# EAGLE design xbee_remote (EAGLE 6.1)
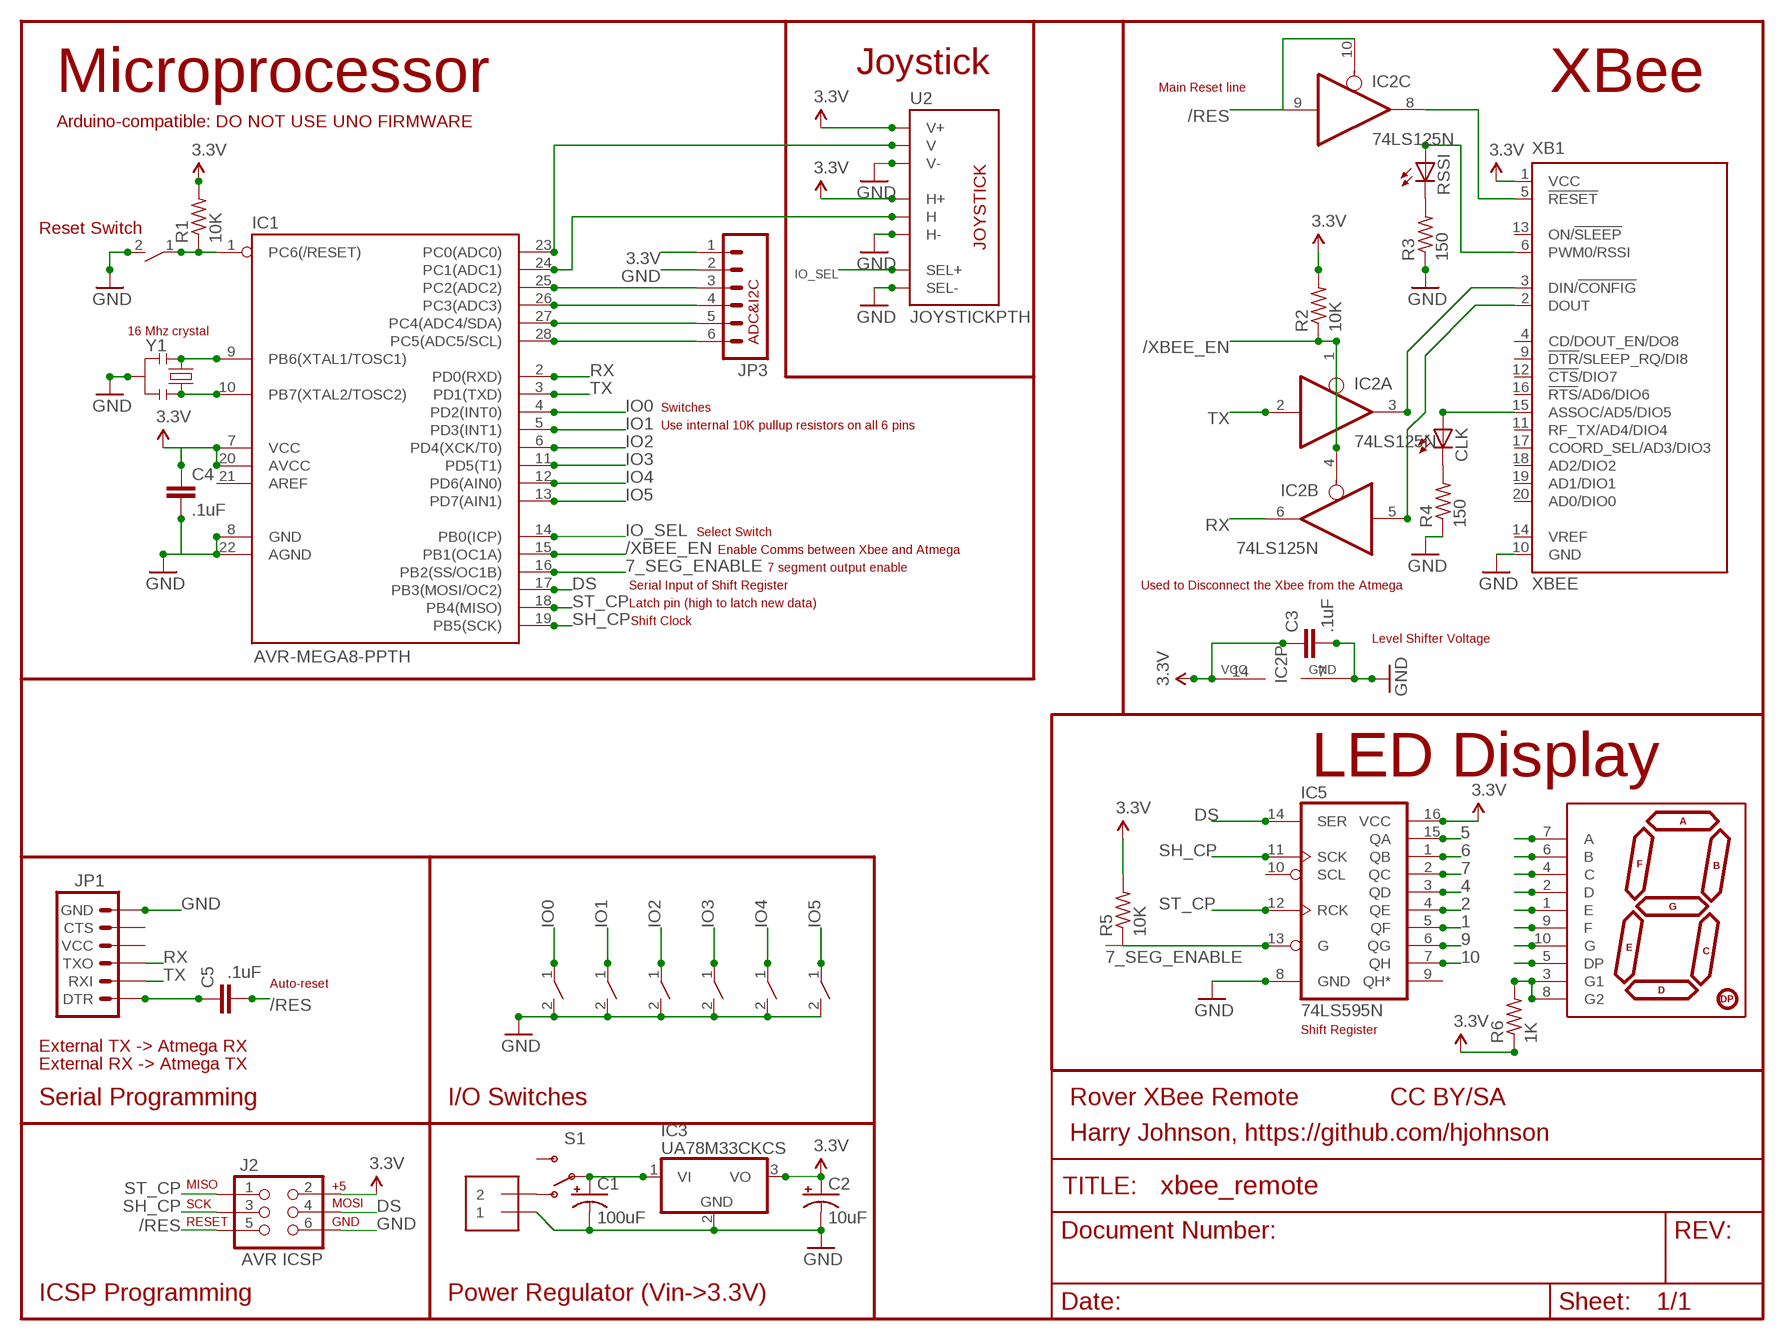
[diagram p0: schematic, sheet 1]

## Parts
C1  100uF  CAP_POLPTH1  [CPOL-RADIAL-100UF-25V]
C2  10uF  CAP_POLPTH2  [CPOL-RADIAL-10UF-25V]
C3  .1uF  CAPPTH2  [CAP-PTH-SMALL2]
C4  .1uF  CAPPTH2  [CAP-PTH-SMALL2]
C5  .1uF  CAPPTH2  [CAP-PTH-SMALL2]
CLK  LED3MM  [LED3MM]
IC1  AVR-MEGA8-PPTH  [DIL28-3]
IC2  74LS125N  [DIL14]
IC3  UA78M33CKCS  786TV  [TO220V]
IC5  74LS595N  [DIL16]
J1  1X2-3.5MM  [3.5MMTERM]
J2  AVR ICSP  AVR_SPI_PRG_6PTH  [2X3]
JP1  ARDUINO_SERIAL_PROGRAMPTH  [1X06]
JP3  M06SIP  [1X06]
R1  10K  R-US_0207/10  [0207/10]
R2  10K  R-US_0207/10  [0207/10]
R3  150  R-US_0207/10  [0207/10]
R4  150  R-US_0207/10  [0207/10]
R5  10K  R-US_0207/10  [0207/10]
R6  1K  R-US_0207/10  [0207/10]
RSSI  LED3MM  [LED3MM]
S1  SWITCH-SPSTPTH  [SWITCH-SPDT]
U2  JOYSTICKPTH  [JOYSTICK]
U$4  7-SEGMENT-DISPLAY-1"-RED  [7-SEGMENT-1"PTH]
U$8  TACT_TL1107  [TACT_TL1107]
U$9  TACT_TL1107  [TACT_TL1107]
U$10  TACT_TL1107  [TACT_TL1107]
U$11  TACT_TL1107  [TACT_TL1107]
U$12  TACT_TL1107  [TACT_TL1107]
U$13  TACT_TL1107  [TACT_TL1107]
U$14  TACT_TL1107  [TACT_TL1107]
XB1  XBEE  [XBEE]
Y1  RESONATORPTH  [RESONATOR-PTH]

## Nets
1: IC5.5(QF) U$4.1(E)
2: IC5.4(QE) U$4.2(D)
3.3V: C2.1(+) C3.1 C4.1 IC1.7(VCC) IC1.20(AVCC) IC2.14(P:VCC) IC3.3(VO) IC5.16(VCC) J2.2 JP3.1 R1.2 R2.2 R5.2 R6.1 U2.H1(H+) U2.V1(V+) XB1.1(VCC)
3V3_/RST: IC2.8(C:O) XB1.5(!RESET)
3V3_RX: IC2.5(B:I) XB1.2(DOUT)
3V3_TX: IC2.3(A:O) XB1.3(DIN/!CONFIG)
4: IC5.3(QD) U$4.4(C)
5: IC5.15(QA) U$4.5(DP)
6: IC5.1(QB) U$4.6(B)
7: IC5.2(QC) U$4.7(A)
7_SEG_ENABLE: IC1.16(PB2(SS/OC1B)) IC5.13(G) R5.1
9: IC5.6(QG) U$4.9(F)
10: IC5.7(QH) U$4.10(G)
/RES: C5.2 IC1.1(PC6(/RESET)) IC2.9(C:I) IC2.10(C:OE) J2.5 R1.1 U$8.1
/XBEE_EN: IC1.15(PB1(OC1A)) IC2.1(A:OE) IC2.4(B:OE) R2.1
A2: IC1.25(PC2(ADC2)) JP3.3
A3: IC1.26(PC3(ADC3)) JP3.4
DS: IC1.17(PB3(MOSI/OC2)) IC5.14(SER) J2.4
GND: C1.2(-) C2.2(-) C3.2 C4.2 IC1.8(GND) IC1.22(AGND) IC2.7(P:GND) IC3.2(GND) IC5.8(GND) J1.1 J2.6 JP1.6(GND) JP3.2 R3.1 R4.1 U2.B2A(SEL-) U2.H3(H-) U2.V3(V-) U$8.2 U$9.2 U$10.2 U$11.2 U$12.2 U$13.2 U$14.2 XB1.10(GND) Y1.2
IO0: IC1.4(PD2(INT0)) U$9.1
IO1: IC1.5(PD3(INT1)) U$10.1
IO2: IC1.6(PD4(XCK/T0)) U$11.1
IO3: IC1.11(PD5(T1)) U$12.1
IO4: IC1.12(PD6(AIN0)) U$13.1
IO5: IC1.13(PD7(AIN1)) U$14.1
IO_SEL: IC1.14(PB0(ICP)) U2.B1A(SEL+)
N$1: IC1.9(PB6(XTAL1/TOSC1)) Y1.1
N$2: IC1.10(PB7(XTAL2/TOSC2)) Y1.3
N$4: J1.2 S1.1(O)
N$8: C5.1 JP1.1(DTR)
N$10: R6.2 U$4.3(G1) U$4.8(G2)
N$24: RSSI.A XB1.6(PWM0/RSSI)
N$25: R3.2 RSSI.K(C)
N$26: CLK.A XB1.15(ASSOC/AD5/DIO5)
N$27: CLK.K(C) R4.2
RX: IC1.2(PD0(RXD)) IC2.6(B:O) JP1.3(TXO)
SCL: IC1.28(PC5(ADC5/SCL)) JP3.6
SDA: IC1.27(PC4(ADC4/SDA)) JP3.5
SH_CP: IC1.19(PB5(SCK)) IC5.11(SCK) J2.3
ST_CP: IC1.18(PB4(MISO)) IC5.12(RCK) J2.1
TX: IC1.3(PD1(TXD)) IC2.2(A:I) JP1.2(RXI)
VIN: C1.1(+) IC3.1(VI) S1.2(P)
VIN_H: IC1.24(PC1(ADC1)) U2.H2(H)
VIN_V: IC1.23(PC0(ADC0)) U2.V2(V)
Unconnected: IC1.21(AREF) IC2.11(D:O) IC2.12(D:I) IC2.13(D:OE) IC5.9(QH*) IC5.10(SCL) JP1.4(VCC) JP1.5(CTS) S1.3(S) XB1.4(CD/DOUT_EN/DO8) XB1.9(!DTR!/SLEEP_RQ/DI8) XB1.11(RF_TX/AD4/DIO4) XB1.12(!CTS!/DIO7) XB1.13(ON/!SLEEP) XB1.14(VREF) XB1.16(!RTS!/AD6/DIO6) XB1.17(COORD_SEL/AD3/DIO3) XB1.18(AD2/DIO2) XB1.19(AD1/DIO1) XB1.20(AD0/DIO0)

## Notes on the sheet
- Joystick
- Microprocessor | Main Reset line | XBee
- Arduino-compatible: DO NOT USE UNO FIRMWARE
- Reset Switch
- 16 Mhz crystal
- ADC&I2C
- Switches
- Use internal 10K pullup resistors on all 6 pins
- Select Switch
- Enable Comms between Xbee and Atmega
- 7 segment output enable
- Serial Input of Shift Register | Used to Disconnect the Xbee from the Atmega
- Latch pin (high to latch new data)
- Shift Clock
- Level Shifter Voltage
- LED Display
- Auto-reset
- Shift Register
- External TX -> Atmega RX
- External RX -> Atmega TX
- Serial Programming | I/O Switches | Rover XBee Remote | CC BY/SA
- Harry Johnson, https://github.com/hjohnson
- ICSP Programming | Power Regulator (Vin->3.3V)

## Library data of the parts
C1 C2 = SparkFun:CAP_POL: Capacitor Polarized These are standard SMD and PTH capacitors. Normally 10uF, 47uF, and 100uF in electrolytic and tantalum varieties. Always verify the external diameter of the through hole cap, it varies with capacity, voltage, and manufacturer. The EIA devices should be standard.
C3-C5 = SparkFun:CAP: Capacitor Standard 0603 ceramic capacitor, and 0.1" leaded capacitor.
CLK RSSI = adafruit:LED: LED OSRAM: - CHIPLED LG R971, LG N971, LY N971, LG Q971, LY Q971, LO R971, LY R971 LH N974, LH R974 LS Q976, LO Q976, LY Q976 LO Q996 - Hyper CHIPLED LW Q18S LB Q993, LB Q99A, LB R99A - SideLED LS A670, LO A670, LY A670, LG A670, LP A670 LB A673, LV A673, LT A673, LW A673 LH A674 LY A675 LS A676, LA A676, LO A676, LY A676, LW A676 LS A679, LY A679, LG A679 - Hyper Micro SIDELED® LS Y876, LA Y876, LO Y876, LY Y876 LT Y87S - SmartLED LW L88C, LW L88S LB L89C, LB L89S, LG L890 LS L89K, LO L89K, LY L89K LS L896, LA L896, LO L896, LY L896 - TOPLED LS T670, LO T670, LY T670, LG T670, LP T670 LSG T670, LSP T670, LSY T670, LOP T670, LYG T670 LG T671, LOG T671, LSG T671 LB T673, LV T673, LT T673, LW T673 LH T674 LS T676, LA T676, LO T676, LY T676, LB T676, LH T676, LSB T676, LW T676 LB T67C, LV T67C, LT T67C, LS T67K, LO T67K, LY T67K, LW E67C LS E67B, LA E67B, LO E67B, LY E67B, LB E67C, LV E67C, LT E67C LW T67C LS T679, LY T679, LG T679 LS T770, LO T770, LY T770, LG T770, LP T770 LB T773, LV T773, LT T773, LW T773 LH T774 LS E675, LA E675, LY E675, LS T675 LS T776, LA T776, LO T776, LY T776, LB T776 LHGB T686 LT T68C, LB T68C - Hyper Mini TOPLED® LB M676 - Mini TOPLED Santana® LG M470 LS M47K, LO M47K, LY M47K Source: http://www.osram.convergy.de/
IC1 = SparkFun:AVR-MEGA8-P: MICROCONTROLLER 8 Kbytes FLASH 1 kbytes SRAM 512 bytes EEPROM USART 4-channel 10 bit ADC 2-channel 8 bit ADC
IC2 = 74xx-us:74*125: Quad bus BUFFER, 3-state
IC3 = linear:78*: Positive VOLTAGE REGULATOR Source: http://cache.national.com/ds/LM/LM78L05.pdf http://www.fairchildsemi.com/ds/LM/LM7805.pdf
IC5 = SparkFun:74*595: 8-bit SHIFT REGISTER, output latch
J1 = adafruit:1X2: 3.5mm Terminal block http://www.ladyada.net/library/pcb/eaglelibrary.html
J2 = SparkFun:AVR_SPI_PRG_6: AVR ISP 6 Pin This is the reduced ISP connector for AVR programming. Common on Arduino. This footprint will take up less PCB space and can be used with a 10-pin to 6-pin adapter such as SKU: BOB-08508
JP1 = SparkFun:ARDUINO_SERIAL_PROGRAM
JP3 = SparkFun:M06: Header 6 Standard 6-pin 0.1" header. Use with straight break away headers (SKU : PRT-00116), right angle break away headers (PRT-00553), swiss pins (PRT-00743), machine pins (PRT-00117), and female headers (PRT-00115). Molex polarized connector foot print use with SKU : PRT-08094 with associated crimp pins and housings. NOTES ON THE VARIANTS LOCK and LOCK_LONGPADS... This footprint was designed to help hold the alignment of a through-hole component (i.e. 6-pin header) while soldering it into place. You may notice that each hole has been shifted either up or down by 0.005 of an inch from it's more standard position (which is a perfectly straight line). This slight alteration caused the pins (the squares in the middle) to touch the edges of the holes. Because they are alternating, it causes a "brace" to hold the component in place. 0.005 has proven to be the perfect amount of "off-center" position when using our standard breakaway headers. Although looks a little odd when you look at the bare footprint, once you have a header in there, the alteration is very hard to notice. Also, if you push a header all the way into place, it is covered up entirely on the bottom side. This idea of altering the position of holes to aid alignment will be further integrated into the Sparkfun Library for other footprints. It can help hold any component with 3 or more connection pins.
R1-R6 = adafruit:R-US_: RESISTOR, American symbol
S1 = SparkFun:SWITCH-SPST: SPST Switch Simple slide switch. Spark Fun Electronics SKU : COM-00102
U2 = SparkFun:JOYSTICK: Thumb Joystick Joystick commonly found in PS2 controllers. Two pots and a select switch. Footprint proven. Spark Fun Electronics SKU : COM-09032
U$4 = SparkFun:7-SEGMENT-DISPLAY-1"-RED: 7-Segment Display 1" Red (COM-08546)
U$8-U$14 = customswitch:TACT_TL1107: Tactile Switch, 2 pin, TL1107 http://search.digikey.com/scripts/DkSearch/dksus.dll?Detail&name=EG2513-ND
XB1 = hjohnson_library:XBEE: XBee (TM) /XBee-PRO(TM) OEM RF Modules Source: MaxStream, Inc. xbee_productmanual.pdf; MPN: XBP24-Z7UIT-004; OC_FARNELL: 1751799; OC_NEWARK: 34R5507
Y1 = SparkFun:RESONATOR: Resonator Small SMD resonator. This is the itty bitty 10/20MHz resonators with built in caps. CSTCE10M0G55 and CSTCE20M0V53. Footprint has been reviewed closely but hasn't been tested yet.

## Board
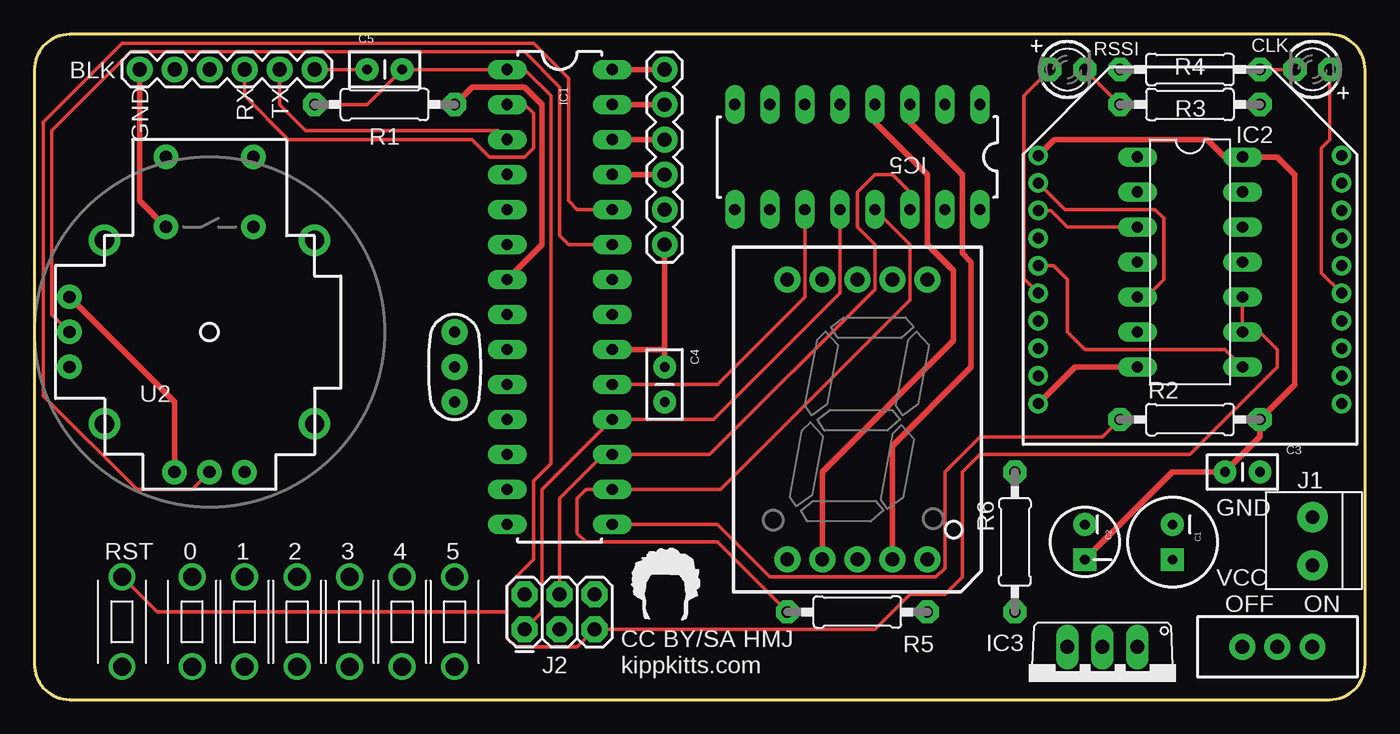
[diagram p1: board, top side]
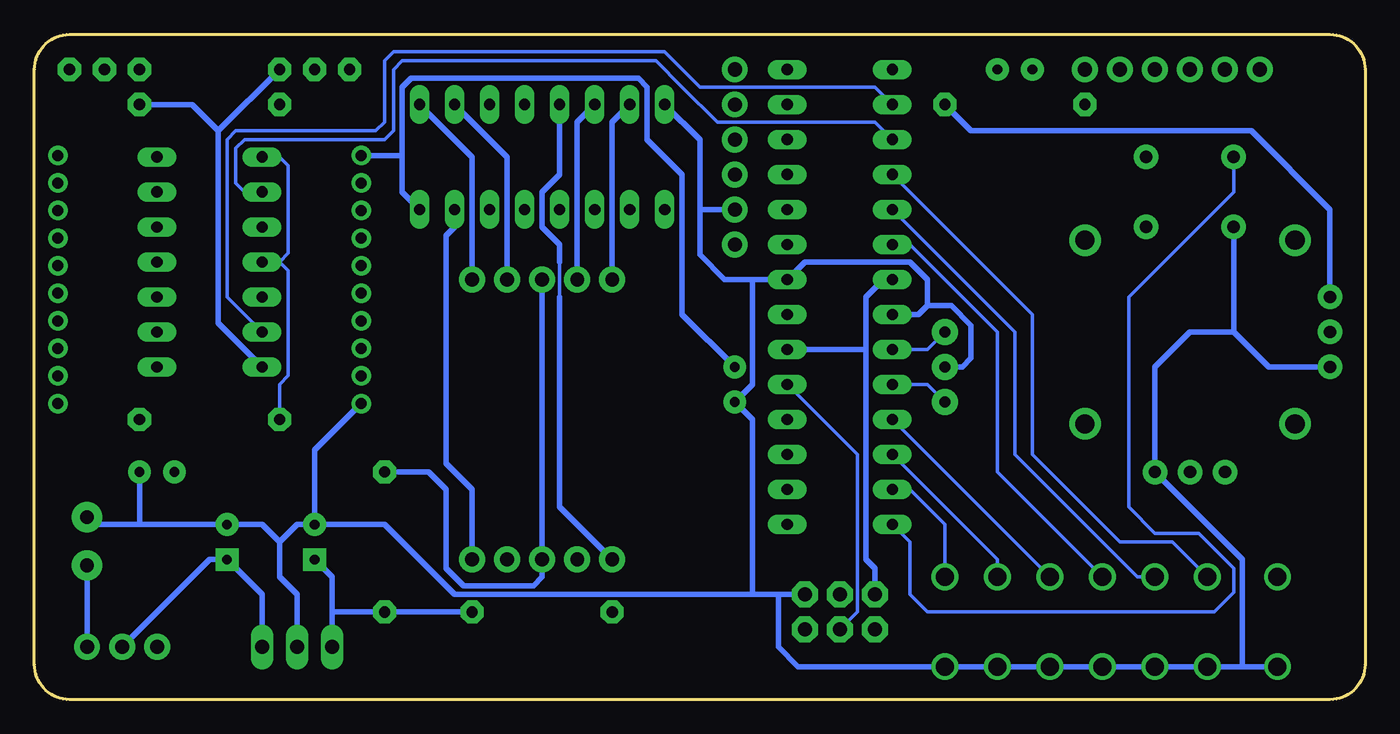
[diagram p2: board, bottom side, seen from below]

Size 96.52 x 48.26 mm. Coordinates in mm from the lower left corner, seen from the top.
Outline: 0,2.54 arc90 2.54,0 93.98,0 arc90 96.52,2.54 96.52,45.72 arc90 93.98,48.26 2.54,48.26 arc90 0,45.72 0,2.54
Copper layers (1*16): Top 0.035mm / dielectric 1.5mm / Bottom 0.035mm
Design rules: minimum track width 8mil, minimum drill 20mil, track to track 8mil, track to pad 8mil, pad to pad 8mil, via to via 8mil, smd to smd 8mil, copper to edge 10mil, drill to drill 8mil, minimum pad ring 12mil, minimum via ring 10mil, stop-mask expansion 4mil, vias tented up to drill 25mil, thermal gap 10mil

### Footprints (pad centres in the part's own frame; a part is rotated, then mirrored left to right if it is on the bottom)
CPOL-RADIAL-100UF-25V = drill 0.7 pad 1.651 square: 1 1.27,0 | drill 0.7 pad 1.651: 2 -1.27,0
CPOL-RADIAL-10UF-25V = drill 0.7 pad 1.651 square: 1 1.27,0 | drill 0.7 pad 1.651: 2 -1.27,0
CAP-PTH-SMALL2 = drill 0.7 pad 1.651: 1 0,0; 2 2.54,0
LED3MM = drill 0.813 pad 1.676 octagon: A -1.27,0; K 1.27,0
DIL28-3 = drill 0.813 long: 1 -16.51,-3.81; 2 -13.97,-3.81; 3 -11.43,-3.81; 4 -8.89,-3.81; 5 -6.35,-3.81; 6 -3.81,-3.81; 7 -1.27,-3.81; 8 1.27,-3.81; 9 3.81,-3.81; 10 6.35,-3.81; 11 8.89,-3.81; 12 11.43,-3.81; 13 13.97,-3.81; 14 16.51,-3.81; 15 16.51,3.81; 16 13.97,3.81; 17 11.43,3.81; 18 8.89,3.81; 19 6.35,3.81; 20 3.81,3.81; 21 1.27,3.81; 22 -1.27,3.81; 23 -3.81,3.81; 24 -6.35,3.81; 25 -8.89,3.81; 26 -11.43,3.81; 27 -13.97,3.81; 28 -16.51,3.81
DIL14 = drill 0.813 long: 1 -7.62,-3.81; 2 -5.08,-3.81; 3 -2.54,-3.81; 4 0,-3.81; 5 2.54,-3.81; 6 5.08,-3.81; 7 7.62,-3.81; 8 7.62,3.81; 9 5.08,3.81; 10 2.54,3.81; 11 0,3.81; 12 -2.54,3.81; 13 -5.08,3.81; 14 -7.62,3.81
TO220V = drill 1.016 long: 1 -2.54,-2.54; 2 0,-2.54; 3 2.54,-2.54
DIL16 = drill 0.813 long: 1 -8.89,-3.81; 2 -6.35,-3.81; 3 -3.81,-3.81; 4 -1.27,-3.81; 5 1.27,-3.81; 6 3.81,-3.81; 7 6.35,-3.81; 8 8.89,-3.81; 9 8.89,3.81; 10 6.35,3.81; 11 3.81,3.81; 12 1.27,3.81; 13 -1.27,3.81; 14 -3.81,3.81; 15 -6.35,3.81; 16 -8.89,3.81
3.5MMTERM = drill 1 pad 2.184: 1 1.8,0; 2 -1.7,0
2X3 = drill 1.016 pad 1.88 octagon: 1 0,0; 2 0,2.54; 3 2.54,0; 4 2.54,2.54; 5 5.08,0; 6 5.08,2.54
1X06 = drill 1.016 pad 1.88: 1 0,0; 2 2.54,0; 3 5.08,0; 4 7.62,0; 5 10.16,0; 6 12.7,0
0207/10 = drill 0.813 pad 1.676 octagon: 1 -5.08,0; 2 5.08,0
SWITCH-SPDT = drill 1.016 pad 1.88: 1 0,2.54; 2 0,0; 3 0,-2.54
JOYSTICK = drill 0.9 pad 1.778: B1A -3.175,12.7; B1B 3.175,12.7; B2A -3.175,7.62; B2B 3.175,7.62 | drill 0.889 pad 1.778: H1 -2.54,-10.16; H2 0,-10.16; H3 2.54,-10.16; V1 -10.16,2.54; V2 -10.16,0; V3 -10.16,-2.54 | drill 1.397 pad 2.286: MOUNT1 -7.62,6.668; MOUNT2 -7.62,-6.668; MOUNT3 7.62,-6.668; MOUNT4 7.62,6.668
7-SEGMENT-1"PTH = drill 1 pad 1.88: 1 -5.08,-10.16; 2 -2.54,-10.16; 3 0,-10.16; 4 2.54,-10.16; 5 5.08,-10.16; 6 5.08,10.16; 7 2.54,10.16; 8 0,10.16; 9 -2.54,10.16; 10 -5.08,10.16
TACT_TL1107 = drill 1.3: 1 0,0; 2 6.5,0
XBEE = drill 0.8 pad 1.27: 1 -11,9; 2 -11,7; 3 -11,5; 4 -11,3; 5 -11,1; 6 -11,-1; 7 -11,-3; 8 -11,-5; 9 -11,-7; 10 -11,-9; 11 11,-9; 12 11,-7; 13 11,-5; 14 11,-3; 15 11,-1; 16 11,1; 17 11,3; 18 11,5; 19 11,7; 20 11,9
RESONATOR-PTH = drill 0.8 pad 1.88: 1 -2.54,0; 2 0,0; 3 2.54,0

### Placement (x,y rotation side)
C1  82.55,11.43 270 top
C2  76.2,11.43 270 top
C3  86.36,16.51 0 top
C4  45.72,24.13 270 top
C5  24.13,45.72 0 top
CLK  92.71,45.72 180 top
IC1  38.1,29.21 270 top
IC2  83.82,31.75 270 top
IC3  77.47,1.27 180 top
IC5  59.69,39.37 180 top
J1  92.71,11.43 90 top
J2  35.56,5.08 0 top
JP1  20.32,45.72 180 top
JP3  45.72,33.02 90 top
R1  25.4,43.18 0 top
R2  83.82,20.32 0 top
R3  83.82,43.18 180 top
R4  83.82,45.72 0 top
R5  59.69,6.35 0 top
R6  71.12,11.43 90 top
RSSI  74.93,45.72 0 top
S1  90.17,3.81 270 top
U2  12.7,26.67 0 top
U$2  [TOP_DOCU_5MM]  42.55,5.08 0 top
U$4  59.69,20.32 0 top
U$8  6.35,8.89 270 top
U$9  11.43,8.89 270 top
U$10  15.24,8.89 270 top
U$11  19.05,8.89 270 top
U$12  22.86,8.89 270 top
U$13  26.67,8.89 270 top
U$14  30.48,8.89 270 top
XB1  83.82,30.48 0 top
Y1  30.48,24.13 270 top

### Tracks (layer width: path | path; a pad name or v marks a point on that pad's centre or on a via)
1
  Bottom 0.254: 58.42,31.75 58.42,29.21
  Bottom 0.406: IC5.5 58.42,38.1 59.69,36.83 59.69,34.29 58.42,33.02 58.42,31.75 | 58.42,29.21 58.42,13.97 U$4.1
2
  Top 0.406: IC5.4 60.96,41.91 64.77,38.1 64.77,33.02 66.67,31.11 66.67,26.04 57.15,16.51 U$4.2
3.3V
  Top 0.406: R1.2 31.75,44.45 35.56,44.45 36.83,43.18 36.83,33.02 IC1.7 | XB1.1 73.98,40.64 85.09,40.64 86.36,39.37 IC2.14 90.17,39.37 91.44,38.1 91.44,22.86 R2.2 88.9,19.05 C3.1 82.55,16.51 C2.1 | 45.72,25.4 IC1.20 | U2.V1 10.16,21.59 U2.H1 | JP3.1 45.72,25.4 | 45.72,25.4 C4.1
  Bottom 0.406: J2.2 35.56,9.53 36.2,10.16 36.2,25.4 | 36.2,25.4 36.2,29.21 34.92,30.48 IC1.7 | R5.2 R6.1 74.93,6.35 | IC1.20 36.2,25.4 | 74.93,6.35 74.93,8.89 C2.1 | U2.V1 2.54,35.56 8.26,41.27 28.57,41.27 R1.2 | 74.93,6.35 IC3.3 | C4.1 49.53,27.94 49.53,38.1 52.07,40.64 52.07,44.45 52.7,45.09 69.22,45.09 69.85,44.45 69.85,39.37 | 69.85,39.37 69.96,39.48 XB1.1 | 69.85,39.37 69.85,36.83 IC5.16
3V3_/RST
  Top 0.254: IC2.8 86.36,25.4 76.2,25.4 74.93,26.67 74.93,30.48 73.93,31.48 XB1.5
3V3_RX
  Top 0.254: IC2.5 80.64,29.21 81.92,30.48 81.92,34.92 81.28,35.56 74.74,35.56 XB1.2
3V3_TX
  Top 0.254: IC2.3 74.93,34.29 73.74,35.48 XB1.3
4
  Top 0.406: IC5.3 63.5,41.91 67.31,38.1 67.31,32.38 67.94,31.75 67.94,24.13 62.23,18.41 U$4.4
5
  Bottom 0.406: IC5.15 66.04,34.29 66.67,33.66 66.67,17.14 64.77,15.24 U$4.5
6
  Bottom 0.406: U$4.6 64.77,39.37 IC5.1
7
  Bottom 0.406: U$4.7 62.23,39.37 IC5.2
7_SEG_ENABLE
  Top 0.254: R5.1 49.53,11.43 40.01,11.43 39.37,12.06 39.37,14.61 40.01,15.24 IC1.16 49.76,15.24 63.5,28.98 63.5,33.02 IC5.13
9
  Bottom 0.406: U$4.9 57.15,41.91 IC5.6
10
  Bottom 0.406: U$4.10 54.61,41.91 IC5.7
/RES
  Top 0.254: 34.29,6.35 34.29,4.45 34.92,3.81 39.37,3.81 J2.5 60.96,5.08 63.5,7.62 66.04,7.62 67.31,8.89 67.31,16.51 68.58,17.78 83.82,17.78 90.17,24.13 90.17,25.4 88.9,26.67 IC2.9 IC2.10 | 34.29,6.35 34.29,8.26 36.2,10.16 36.2,15.88 37.47,17.14 37.47,43.81 35.56,45.72 IC1.1 C5.2 24.13,43.18 R1.1 | 34.29,6.35 8.89,6.35 U$8.1
/XBEE_EN
  Top 0.254: IC1.15 49.53,12.7 53.34,8.89 65.41,8.89 66.04,9.53 66.04,16.51 68.58,19.05 77.47,19.05 R2.1
  Bottom 0.254: IC2.1 78.74,39.37 78.11,38.73 78.11,32.38 78.74,31.75 | 78.74,31.75 IC2.4 | R2.1 78.74,22.86 78.11,23.5 78.11,31.11 78.74,31.75
A2
  Top 0.406: IC1.25 JP3.3
A3
  Top 0.406: IC1.26 JP3.4
DS
  Top 0.254: J2.4 38.1,14.61 41.27,17.78 IC1.17 48.98,17.78 60.96,29.76 60.96,33.02 59.69,34.29 59.69,36.83 60.96,38.1 62.23,38.1 63.5,36.83 IC5.14
GND
  Top 0.406: IC2.7 75.47,24.13 XB1.10 | JP1.6 7.62,36.2 U2.B2A
  Bottom 0.406: 78.74,11.43 78.74,8.89 77.47,7.62 IC3.2 | 78.74,11.43 77.47,12.7 C2.2 | 78.74,11.43 80.01,12.7 C1.2 88.9,12.7 | 88.9,12.7 92.18,12.7 J1.1 | C3.2 88.9,12.7 | IC5.8 48.26,40.64 48.26,35.56 | 48.26,35.56 48.26,32.28 46.46,30.48 44.45,30.48 | 44.45,30.48 IC1.22 40.64,31.75 33.02,31.75 31.75,30.48 31.75,28.57 | 44.45,7.62 44.45,20.32 C4.2 44.45,22.86 44.45,30.48 | U$8.2 8.89,2.39 | 8.89,2.39 U$9.2 U$10.2 U$11.2 U$12.2 U$13.2 U$14.2 41.12,2.39 42.55,3.81 42.55,7.62 | U2.V3 6.99,24.13 9.53,26.67 | 9.53,26.67 U2.B2A | 9.53,26.67 12.7,26.67 15.24,24.13 U2.H3 8.89,10.16 8.89,2.39 | C2.2 76.2,18.1 XB1.10 | IC2.7 83.19,27.3 83.19,41.27 | 83.19,41.27 85.09,43.18 R3.1 | C2.2 71.12,12.7 66.04,7.62 44.45,7.62 | IC1.8 32.38,27.94 31.75,28.57 | 31.75,28.57 30,28.57 28.57,27.16 28.57,24.77 29.21,24.13 Y1.2 | 44.45,7.62 42.55,7.62 | 42.55,7.62 J2.6 | 83.19,41.27 R4.1 | JP3.2 48.26,35.56
IO0
  Bottom 0.254: U$9.1 13.97,11.43 17.78,11.43 24.13,17.78 24.13,27.94 IC1.4
IO1
  Bottom 0.254: U$10.1 16.51,8.89 25.4,17.78 25.4,26.67 IC1.5
IO2
  Bottom 0.254: U$11.1 26.67,16.51 26.67,26.67 33.02,33.02 IC1.6
IO3
  Bottom 0.254: U$12.1 IC1.11
IO4
  Bottom 0.254: U$13.1 26.67,10.16 IC1.12
IO5
  Bottom 0.254: U$14.1 30.48,12.7 33.02,15.24 IC1.13
IO_SEL
  Bottom 0.254: IC1.14 33.02,11.43 33.02,7.62 31.75,6.35 10.95,6.35 9.53,7.77 9.53,9.53 12.06,12.06 15.24,12.06 17.14,13.97 17.14,29.21 9.53,36.83 U2.B1A
N$1
  Bottom 0.254: IC1.9 31.75,25.4 Y1.1
N$2
  Bottom 0.254: IC1.10 31.75,22.86 Y1.3
N$4
  Bottom 0.406: J1.2 S1.1
N$8
  Top 0.254: JP1.1 C5.1
N$10
  Bottom 0.406: U$4.8 U$4.3 59.69,8.89 60.33,8.26 65.41,8.26 66.67,9.53 66.67,15.24 67.94,16.51 R6.2
N$24
  Top 0.254: XB1.6 71.75,30.55 71.75,43.81 RSSI.A
N$25
  Top 0.254: R3.2 RSSI.K
N$26
  Top 0.254: CLK.A 93.98,40.64 93.34,40.01 93.34,30.95 XB1.15
N$27
  Top 0.254: R4.2 CLK.K
RX
  Top 0.254: JP1.3 15.24,43.81 18.41,40.64 31.75,40.64 33.02,39.37 35.56,39.37 36.2,40.01 36.2,42.55 35.56,43.18 IC1.2
  Bottom 0.254: IC2.6 82.55,29.21 82.55,40.64 81.92,41.27 71.75,41.27 71.12,41.91 71.12,46.35 70.48,46.99 50.8,46.99 48.26,44.45 35.56,44.45 IC1.2
SCL
  Top 0.406: IC1.28 JP3.6
SDA
  Top 0.406: IC1.27 JP3.5
SH_CP
  Top 0.254: IC1.19 49.53,22.86 55.88,29.21 IC5.11
  Bottom 0.254: IC1.19 36.83,17.78 36.83,6.35 J2.3
ST_CP
  Top 0.254: J2.1 36.83,6.35 36.83,15.24 IC1.18 49.26,20.32 58.42,29.48 IC5.12
TX
  Top 0.254: JP1.2 17.78,43.18 19.68,41.27 33.66,41.27 IC1.3
  Bottom 0.254: IC2.2 81.28,36.83 81.92,37.47 81.92,40.01 81.28,40.64 71.12,40.64 70.48,41.27 70.48,45.72 69.85,46.35 51.44,46.35 49.53,44.45 46.99,41.91 35.56,41.91 IC1.3
VIN
  Bottom 0.406: S1.2 83.82,10.16 C1.1 80.01,7.62 IC3.1
VIN_H
  Top 0.254: IC1.24 39.37,35.56 38.73,36.2 38.73,45.09 36.2,47.62 6.35,47.62 0.64,41.91 0.64,22.04 7.43,15.24 11.43,15.24 U2.H2
VIN_V
  Top 0.254: U2.V2 1.27,27.94 1.27,41.27 6.99,46.99 35.56,46.99 38.1,44.45 38.1,33.66 38.73,33.02 IC1.23

### Text on the board
tPlace: BLK | GND | RX | TX | GND | RST | 0 | 1 | 2 | 3 | 4 | 5 | VCC | OFF | ON | CC BY/SA HMJ | kippkitts.com
Reference: 7-Segment block | XBEE block | Prog Block | VREG Block